# EAGLE design lpf-40 (EAGLE 9.3.0)
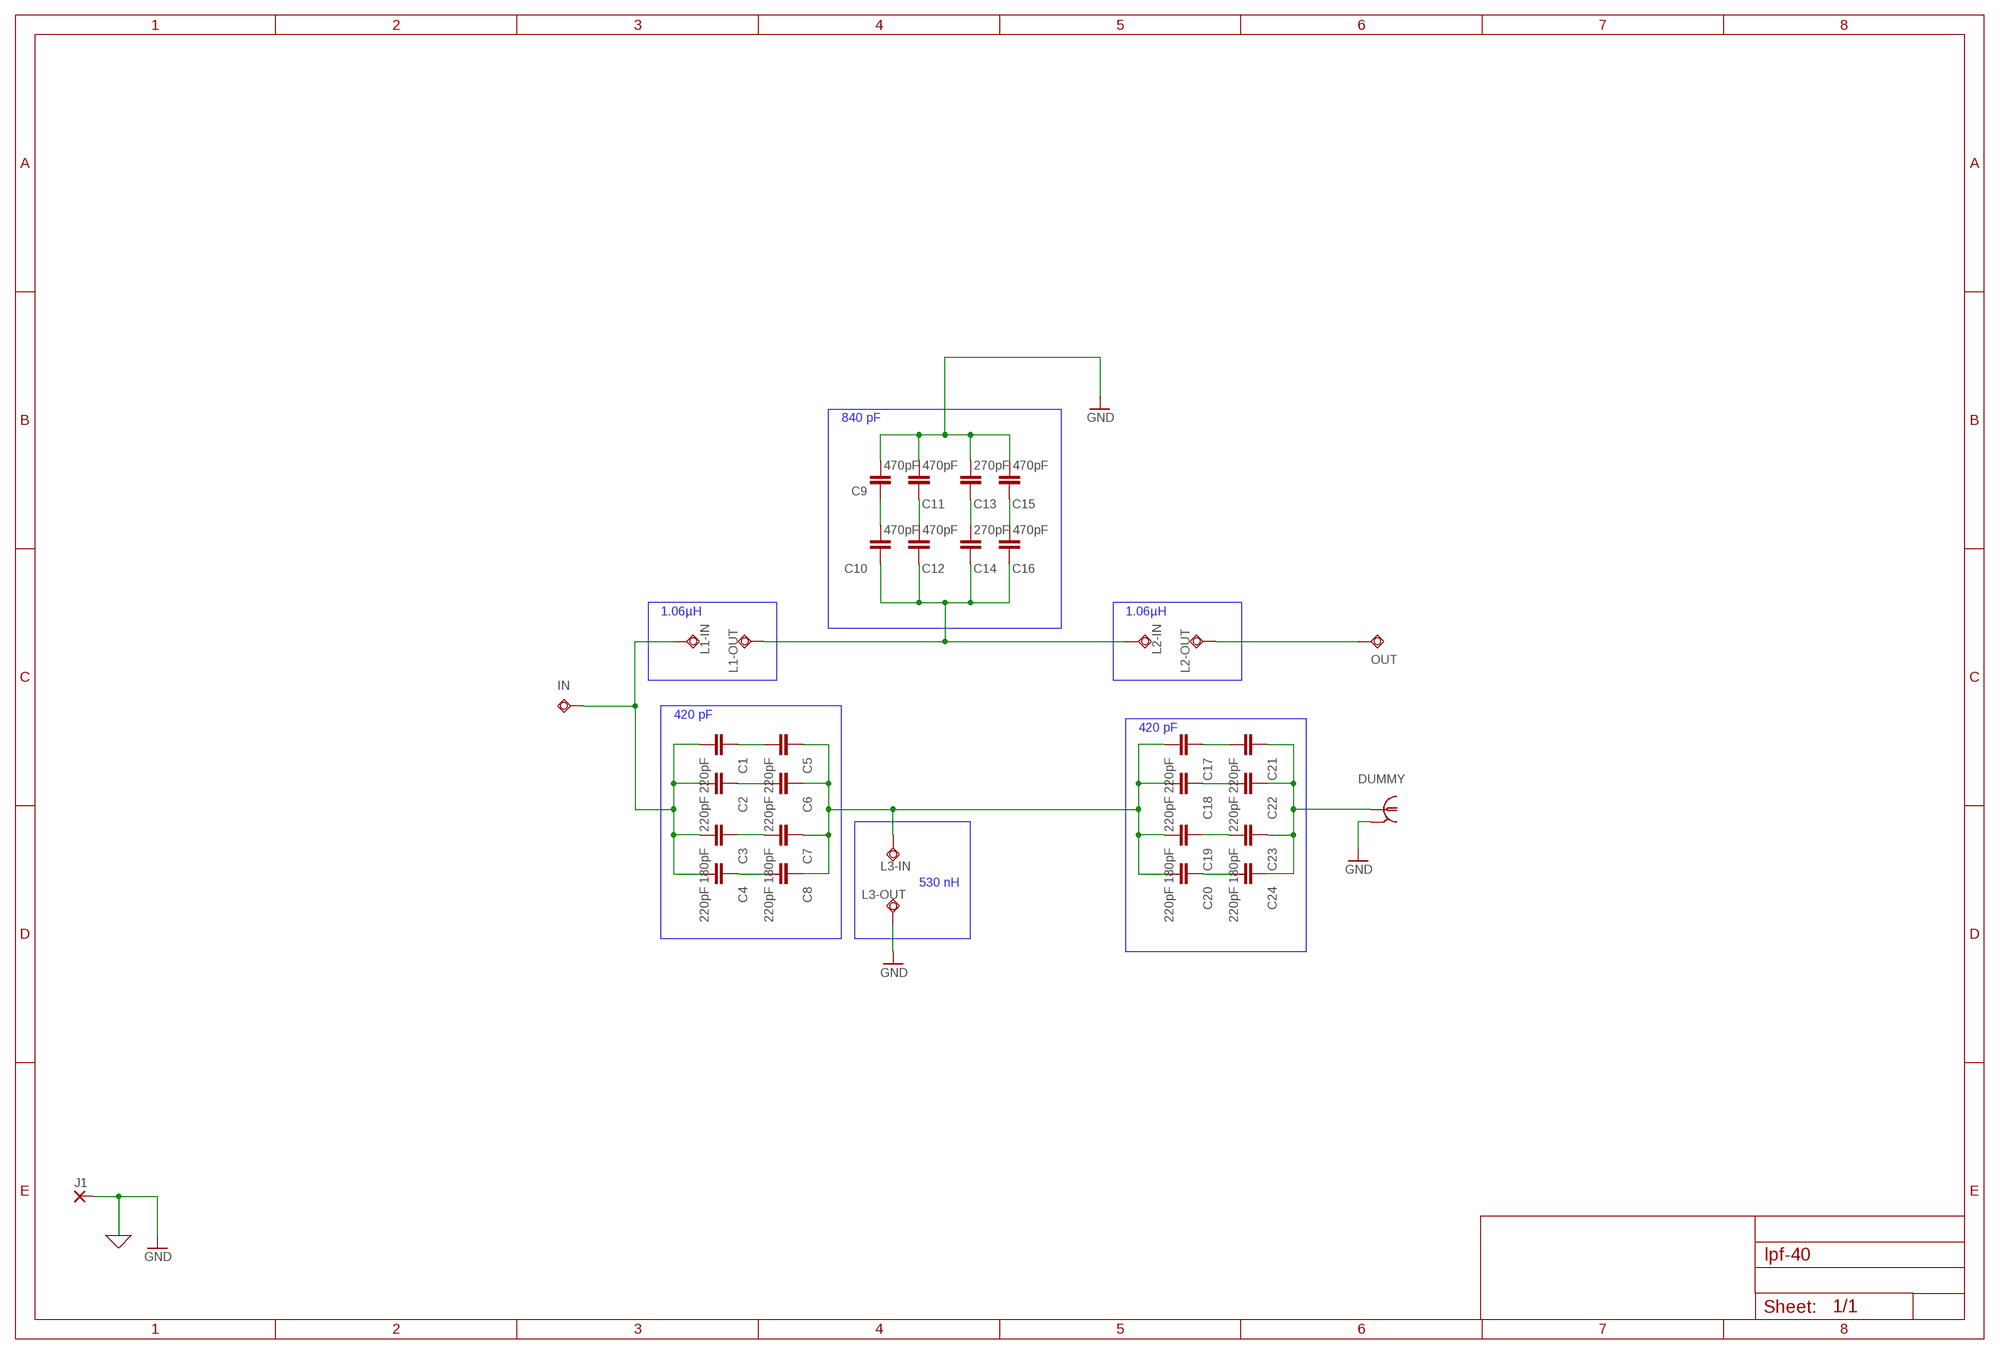
[diagram p0: schematic, sheet 1]

## Parts
C1  220pF  C-1206  [1206]
C2  220pF  C-1206  [1206]
C3  180pF  C-1206  [1206]
C4  220pF  C-1206  [1206]
C5  220pF  C-1206  [1206]
C6  220pF  C-1206  [1206]
C7  180pF  C-1206  [1206]
C8  220pF  C-1206  [1206]
C9  470pF  C-1206  [1206]
C10  470pF  C-1206  [1206]
C11  470pF  C-1206  [1206]
C12  470pF  C-1206  [1206]
C13  270pF  C-1206  [1206]
C14  270pF  C-1206  [1206]
C15  470pF  C-1206  [1206]
C16  470pF  C-1206  [1206]
C17  220pF  C-1206  [1206]
C18  220pF  C-1206  [1206]
C19  180pF  C-1206  [1206]
C20  220pF  C-1206  [1206]
C21  220pF  C-1206  [1206]
C22  220pF  C-1206  [1206]
C23  180pF  C-1206  [1206]
C24  220pF  C-1206  [1206]
DUMMY  SMA-PCB  [SMA-RF]
IN  IN  TPSQTP11R  [TP11R]
J1  JUMPER-1  [JUMPER1]
L1-IN  L1-IN  TPSQTP11R  [TP11R]
L1-OUT  TPSQTP11R  [TP11R]
L2-IN  TPSQTP11R  [TP11R]
L2-OUT  TPSQTP11R  [TP11R]
L3-IN  TPSQTP11R  [TP11R]
L3-OUT  TPSQTP11R  [TP11R]
OUT  TPSQTP11R  [TP11R]

## Nets
DL-O: C21.1 C22.1 C23.1 C24.1 DUMMY.1
DL-P1 [QRP]: C5.1 C6.1 C7.1 C8.1 C17.2 C18.2 C19.2 C20.2 L3-IN.TP
GND: C9.2 C11.2 C13.2 C15.2 DUMMY.2 DUMMY.3 DUMMY.4 DUMMY.5 J1.1(P) L3-OUT.TP
IN [QRP]: C1.2 C2.2 C3.2 C4.2 IN.TP L1-IN.TP
M-P1 [QRP]: C10.1 C12.1 C14.1 C16.1 L1-OUT.TP L2-IN.TP
N$2 [QRP]: C9.1 C10.2
N$3 [QRP]: C11.1 C12.2
N$4 [QRP]: C13.1 C14.2
N$5 [QRP]: C15.1 C16.2
N$7 [QRP]: C17.1 C21.2
N$10 [QRP]: C1.1 C5.2
N$11 [QRP]: C2.1 C6.2
N$12 [QRP]: C3.1 C7.2
N$13 [QRP]: C4.1 C8.2
N$15 [QRP]: C18.1 C22.2
N$16 [QRP]: C19.1 C23.2
N$17 [QRP]: C20.1 C24.2
OUT: L2-OUT.TP OUT.TP

## Notes on the sheet
- 840 pF
- 1.06µH | 1.06µH
- 420 pF
- 420 pF
- 530 nH

## Library data of the parts
C1-C24 = aarf:C-1206
DUMMY = aarf:SMA-PCB
IN L1-IN L1-OUT L2-IN L2-OUT L3-IN L3-OUT OUT = testpad:TPSQ: Test pad
J1 = aarf:JUMPER-1

## Net classes
0 default: clearance 3 mm
1 QRP: clearance 0.3 mm

## Board
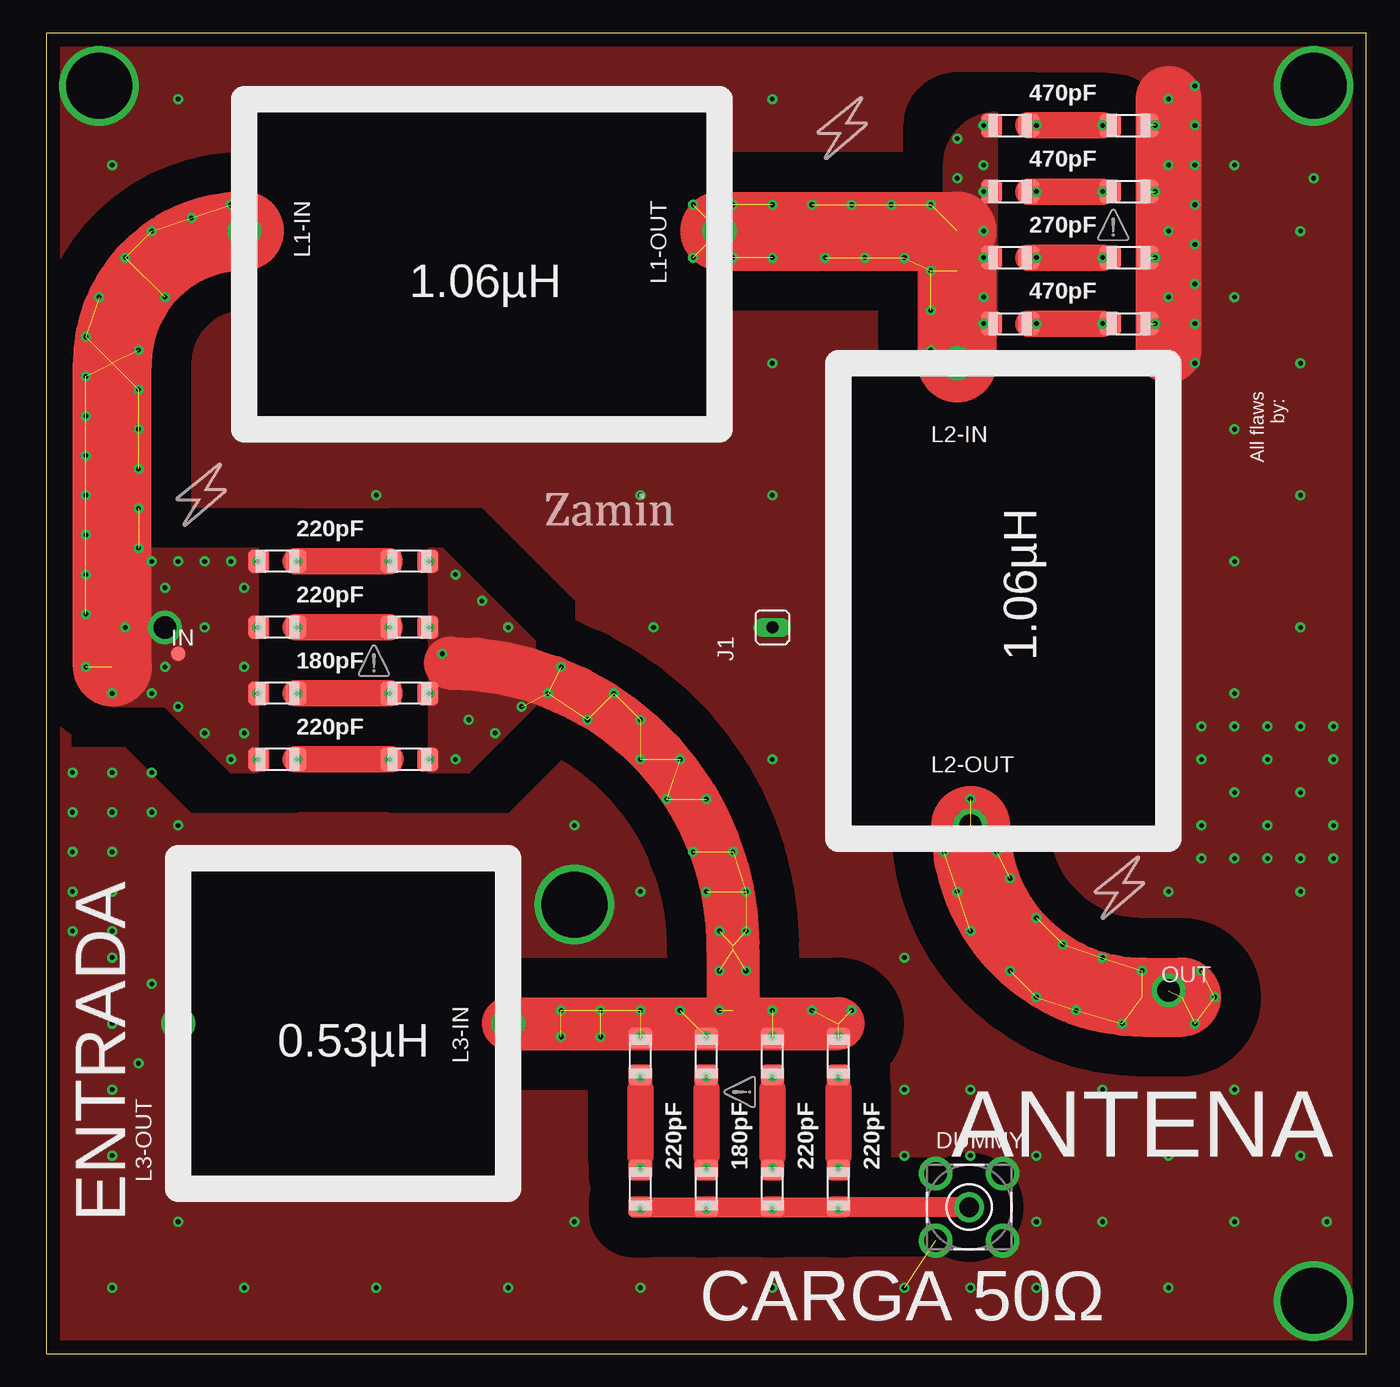
[diagram p1: board, top side]
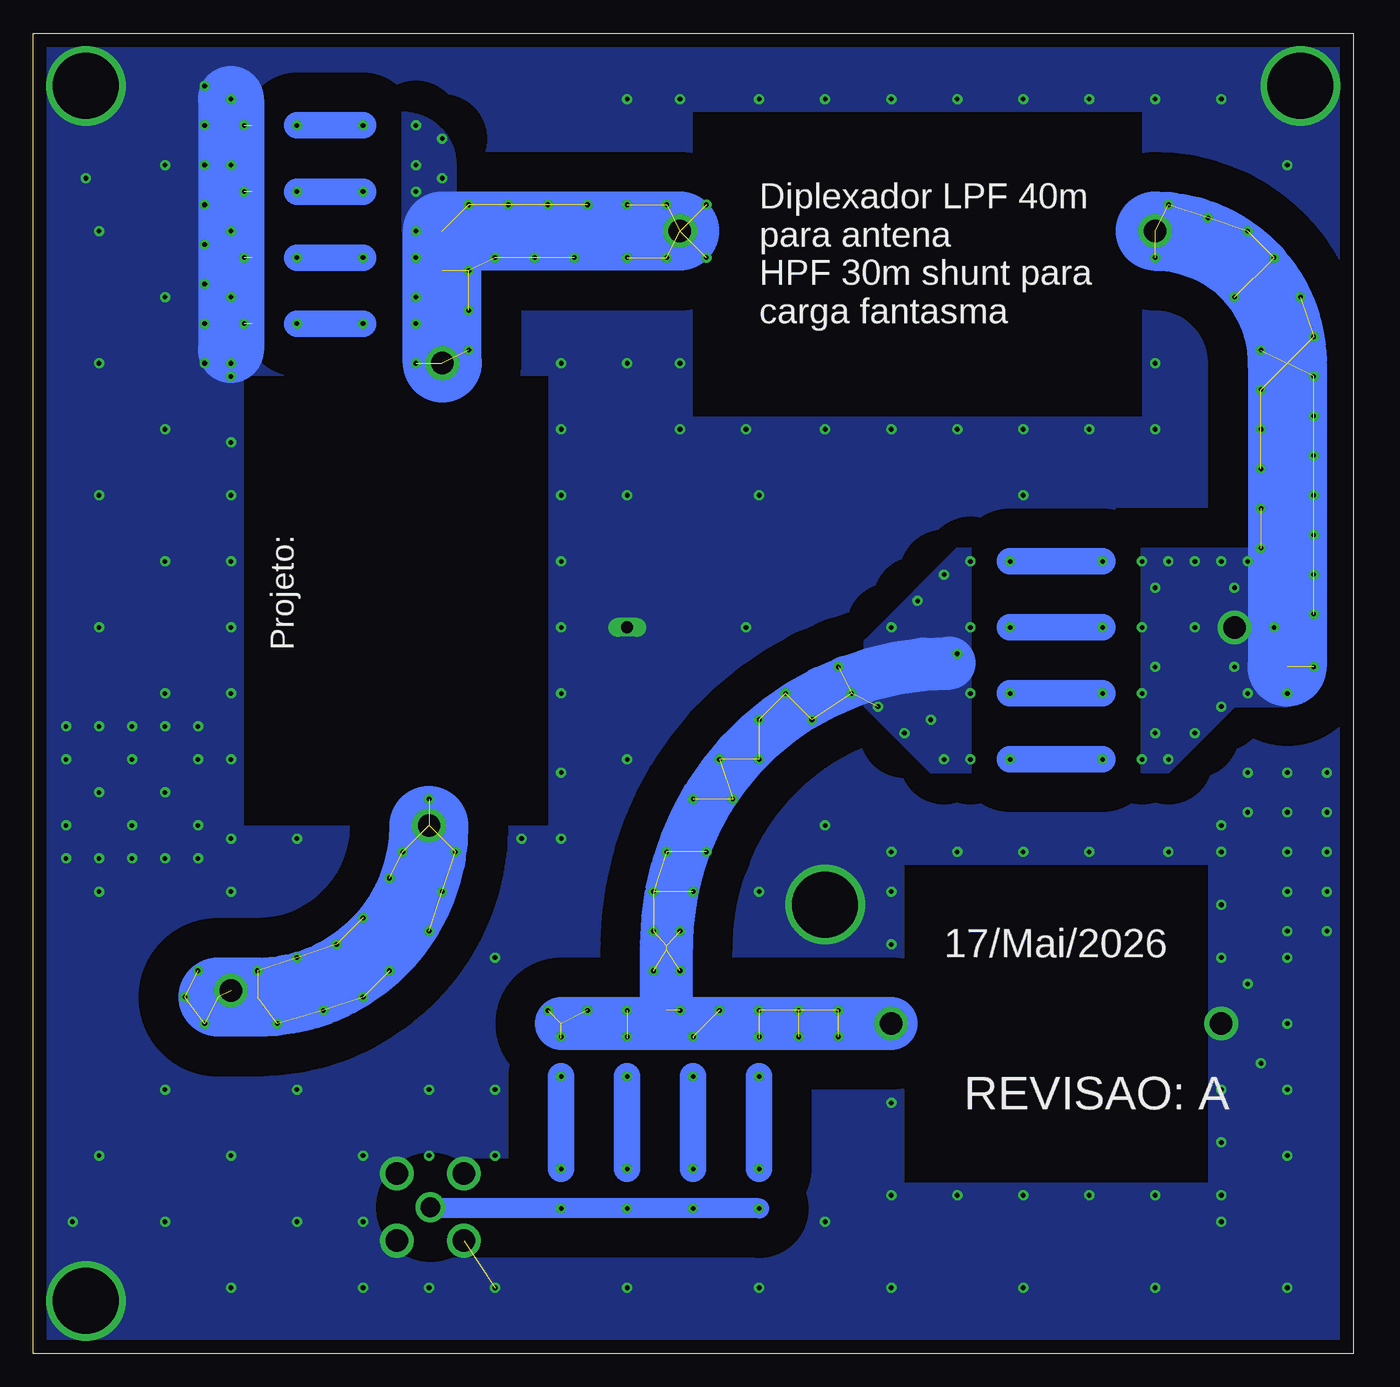
[diagram p2: board, bottom side, seen from below]

Size 100 x 100 mm. Coordinates in mm from the lower left corner, seen from the top.
Outline: 0,0 100,0 100,100 0,100 0,0
Copper layers (1*16): Top 0.035mm / dielectric 1.5mm / Bottom 0.035mm
Design rules "default": minimum track width 6mil, minimum drill 0.35mm, track to track 6mil, track to pad 6mil, pad to pad 6mil, via to via 6mil, smd to smd 6mil, copper to edge 40mil, drill to drill 6mil, minimum pad ring 10mil, minimum via ring 8mil, stop-mask expansion 4mil, vias tented up to drill 0mil, thermal gap 10mil
tRestrict: area 16,71 to 50,94; area 61,40 to 84,74; area 11,13 to 34,37
bRestrict: area 11,62 to 18,64; area 16,71 to 50,94; area 11,13 to 34,37; area 61,40 to 84,74

### Footprints (pad centres in the part's own frame; a part is rotated, then mirrored left to right if it is on the bottom)
1206 = smd 1.6 x 1.8: 1 -1.4,0; 2 1.4,0
SMA-RF = drill 1.5: 1 0,0 | drill 1.7: 2 -2.54,2.54; 3 2.54,2.54; 4 2.54,-2.54; 5 -2.54,-2.54
TP11R = smd 1.1 x 1.1: TP 0,0
JUMPER1 = drill 0.914 long: 1 0,0

### Placement (x,y rotation side)
C1  17.5,60 180 top
C2  17.5,55 180 top
C3  17.5,50 180 top
C4  17.5,45 180 top
C5  27.5,60 180 top
C6  27.5,55 180 top
C7  27.5,50 180 top
C8  27.5,45 180 top
C9  82,93 0 top
C10  73,93 0 top
C11  82,88 0 top
C12  73,88 0 top
C13  82,83 0 top
C14  73,83 0 top
C15  82,78 0 top
C16  73,78 0 top
C17  60,22.5 90 top
C18  55,22.5 90 top
C19  50,22.5 90 top
C20  45,22.5 90 top
C21  60,12.5 90 top
C22  55,12.5 90 top
C23  50,12.5 90 top
C24  45,12.5 90 top
DUMMY  69.9,11.1 0 top
IN  10,53 0 top
J1  55,55 0 top
L1-IN  15,85 0 top
L1-OUT  51,85 0 top
L2-IN  69,75 0 top
L2-OUT  70,40 0 top
L3-IN  35,25 0 top
L3-OUT  10,25 0 top
OUT  85,27.5 0 top

### Tracks (layer width: path | path; a pad name or v marks a point on that pad's centre or on a via)
DL-O
  Top 1.5: DUMMY.1 C21.1 C22.1 C23.1 C24.1
DL-P1  (via drill 0.35, 1.7)  (33 unrouted)
  Top 1: C20.2 C19.2 C18.2 C17.2
  Top 4: L3-IN.TP 60,25 | 52,30.6 52,26 | 30.6,52.3 arc-90 52,30.9
  Bottom 4: L3-IN.TP 52,25 | 52,25 60,25 | 52,25 52,30.9 arc90 30.6,52.3
  other vias: 39,26 39,24 42,26 45,24 42,24 45,26 48,26 51,26 50,24 55,26 55,24 58,26 60,24 61,26 51,29 53,29 51,32 53,32 53,35 50,35 52,38 49,38 50,42 47,42 48,45 45,45 45,48 43,50 41,48 38,50 39,52 32,48 36,49 34,47 30,53 29,45 31,45 33,57 35,55 31,59 29,60 29,55 35,25 29,50
  pour Top (no thermals): 29,61 30,61 37,54 37,53 37,49 32,44 29,44
  pour Bottom (no thermals): 29,61 29,44 32,44 37,49 37,54 30,61
GND  (via drill 0.35, 1.7, 5)  (5 unrouted)
  Top 5: v85,95 85,76
  Bottom 5: v85,95 85,76
  other vias: 10,30 5,25 5,35 10,20 87,93 87,90 87,87 87,84 87,81 97.5,47.5 95,47.5 92.5,47.5 90,47.5 87.5,47.5 87.5,45 92.5,45 97.5,45 95,42.5 90,42.5 92.5,40 87.5,40 97.5,40 97.5,37.5 95,37.5 92.5,37.5 90,37.5 87.5,37.5 10,25 51,70 35,70 25,70 15,75 20,95 51,95 30,95 25,95 40,95 35,95 45,95 55,75 55,65 55,95 15,95 5,90 10,95 87,96 87,78 87,75 85,74 85,90 84,88 84,93 84,83 84,78 85,85 85,80 85,75 20,70 25,65 30,70 40,70 45,65 46,55 60,75 60,50 60,60 85,60 60,65 85,69 60,70 85,50 85,55 90,60 85,65 85,39 60,55 85,45 80,39 63,39 90,50 95,55 95,65 90,70 95,75 95,85 96,89 90,90 90,80 55,45 60,39 60,44 85,35 95,35 45,35 40,40 35,35 35,31 30,38 20,38 25,38 35,38 10,38 15,12 5,15 10,10 5,5 10,12 20,12 25,12 30,12 35,5 40,10 35,19 35,12 25,5 15,5 45,5 55,5 65,5 75,5 75,10 75,15 70,15 70,20 65,20 65,15 70,5 80,10 85,15 90,20 95,15 90,10 85,5 80,20 65,30 97,10 5,38 5,41 8,41 8,44 5,44 2,44 2,41 2,38 2,35 2,32 5,32 10,40 10,34 5,30 5,20 14,38 8,28 10,16 7,22 15,70 46,70 51,75 96,96 4,96 96,4 40,34
  pour Top (rank 4, no thermals): 0,100 0,0 100,0 100,100
  pour Bottom (no thermals): 0,100 0,0 100,0 100,100
IN  (via drill 0.35, 1.7)  (21 unrouted)
  Top 6: L1-IN.TP arc90 5,75 5,52
  Bottom 6: L1-IN.TP arc90 5,75 5,52
  other vias: 15,85 16,60 16,55 16,50 16,45 14,45 15,47 9,55 10,60 14,60 15,52 12,60 8,60 10,49 8,50 5,50 3,52 3,56 9,52 9,58 7,61 3,59 3,62 7,64 7,67 3,65 3,68 7,70 7,73 3,71 3,74 3,77 4,80 7,76 9,80 15,83 14,87 11,86 8,85 6,83 12,47 15,58 12,55 6,55
  pour Top (no thermals): 14,44 9,49 5,49 5,51 7,51 7,61 16,61 16,44
  pour Bottom (no thermals): 16,61 8,61 5,58 5,49 9,49 14,44 16,44
M-P1  (via drill 0.35, 1.7)  (17 unrouted)
  Top 6: L1-OUT.TP 69,85 | L2-IN.TP 69,82
  Bottom 6: L1-OUT.TP 69,85 L2-IN.TP
  other vias: 51,85 49,87 49,83 52,83 55,83 59,83 62,83 65,83 67,82 67,87 64,87 61,87 58,87 55,87 52,87 69,89 69,92 71,90 71,88 71,93 71,78 67,76 67,79 69,75 71,75 71,83 71,85 71,80
  pour Top (no thermals): 72,94 72,77 arc-90 68,81 68,89 68,90 arc-90
  pour Top (no thermals): 72,94 72,77 arc-90 68,81 68,89 68,90 arc-90
  pour Bottom (no thermals): 72,94 arc90 68,90 68,85 72,85
N$1  (via drill 0.35)
  Bottom 1.5: v45,11 70,11
N$2  (via drill 0.35)
  Top 1: v75,93 75.5,93 | 79.5,93 v80,93 C9.1
  Top 2: C10.2 v75,93 v80,93
  Bottom 2: v75,93 v80,93
N$3  (via drill 0.35)
  Top 1: v75,88 75.5,88 | 79.5,88 v80,88 C11.1
  Top 2: C12.2 v75,88 v80,88
  Bottom 2: v80,88 v75,88
N$4  (via drill 0.35)
  Top 1: v75,83 75.5,83 | 79.5,83 v80,83 C13.1
  Top 2: C14.2 v75,83 v80,83
  Bottom 2: v80,83 v75,83
N$5  (via drill 0.35)
  Top 1: v75,78 75.5,78 | 79.5,78 v80,78 C15.1
  Top 2: C16.2 v75,78 v80,78
  Bottom 2: v80,78 v75,78
N$6  (via drill 0.35)
  other vias: 50,11
N$7  (via drill 0.35)
  Top 1: C17.1 v60,21 60,20 | 60,15 v60,14 C21.2
  Top 2: 60,20 60,15
  Bottom 2: v60,21 v60,14
N$9  (via drill 0.35)
  other vias: 55,11
N$10  (via drill 0.35)
  Top 1: v26,60 C5.2
  Top 2: C1.1 v19,60 v26,60
  Bottom 2: v19,60 v26,60
N$11  (via drill 0.35)
  Top 1: v26,55 C6.2
  Top 2: C2.1 v19,55 v26,55
  Bottom 2: v19,55 v26,55
N$12  (via drill 0.35)
  Top 1: v26,50 C7.2
  Top 2: C3.1 v19,50 v26,50
  Bottom 2: v26,50 v19,50
N$13  (via drill 0.35)
  Top 2: C4.1 v19,45 v26,45 C8.2
  Bottom 2: v19,45 v26,45
N$14  (via drill 0.35)
  other vias: 60,11
N$15  (via drill 0.35)
  Top 1: C18.1 v55,21 55,20 | 55,15 v55,14 C22.2
  Top 2: 55,20 55,15
  Bottom 2: v55,14 v55,21
N$16  (via drill 0.35)
  Top 1: C19.1 v50,21 50,20 | 50,15 v50,14 C23.2
  Top 2: 50,20 50,15
  Bottom 2: v50,21 v50,14
N$17  (via drill 0.35)
  Top 1: C20.1 v45,21 45,20 | 45,15 v45,14 C24.2
  Top 2: 45,20 45,15
  Bottom 2: v45,21 v45,14
OUT  (via drill 0.35, 1.7)  (18 unrouted)
  Top 6: L2-OUT.TP arc90 83,27 86,27
  Bottom 6: L2-OUT.TP arc90 83,27 86,27
  other vias: 77,31 70,42 70,40 85,27.5 68,38 72,38 69,35 75,33 73,36 70,32 73,29 75,27 78,26 80,30 81.5,25 87,25 83,29 87.5,29 88.5,27

### Text on the board
tPlace: 1.06µH | All flaws / by: | 1.06µH | 0.53µH | ANTENA | ENTRADA | CARGA 50Ω
bPlace: Diplexador LPF 40m / para antena / HPF 30m shunt para / carga fantasma | Projeto: | 17/Mai/2026 | REVISAO: A
tStop: DIPLEXER / 40M
bStop: PY2RAF